# Altium schematic sheet IOT_GRN_MAIN V1.0 A - CONNECTORS.SchDoc
size A4; SheetNumber: 3; SheetTotal: 4
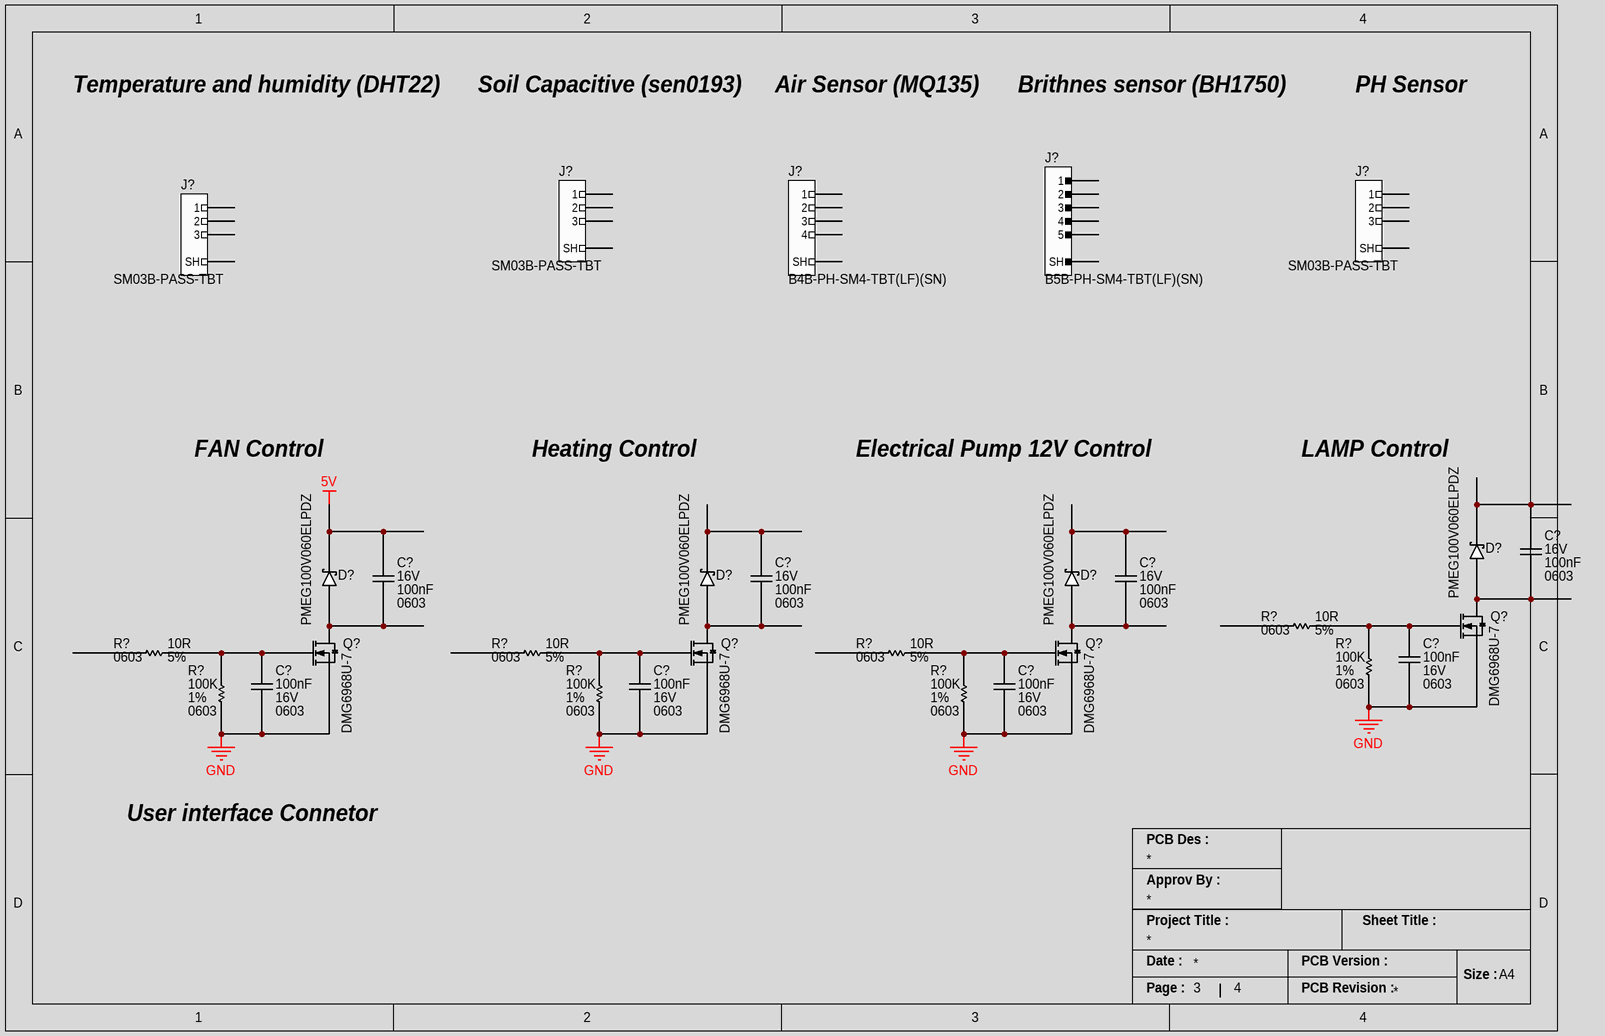
[diagram p0: IOT_GRN_MAIN V1.0 A - CONNECTORS.SchDoc]

## Parts
(Parts that share a designator on the sheet are numbered #1, #2 ... from top to bottom, then left to right.)
C?#1  Voltage: 16V  Capacitance: 100nF  Case/Package: 0603  [CAP_0603_CAPC1608X08N]  (hidden comment: CL10B104KO8NNNC)
C?#2  Voltage: 16V  Capacitance: 100nF  Case/Package: 0603  [CAP_0603_CAPC1608X08N]  (hidden comment: CL10B104KO8NNNC)
C?#3  Voltage: 16V  Capacitance: 100nF  Case/Package: 0603  [CAP_0603_CAPC1608X08N]  (hidden comment: CL10B104KO8NNNC)
C?#4  Voltage: 16V  Capacitance: 100nF  Case/Package: 0603  [CAP_0603_CAPC1608X08N]  (hidden comment: CL10B104KO8NNNC)
C?#5  Voltage: 16V  Capacitance: 100nF  Case/Package: 0603  [CAP_0603_CAPC1608X08N]  (hidden comment: CL10B104KO8NNNC)
C?#6  Voltage: 16V  Capacitance: 100nF  Case/Package: 0603  [CAP_0603_CAPC1608X08N]  (hidden comment: CL10B104KO8NNNC)
C?#7  Voltage: 16V  Capacitance: 100nF  Case/Package: 0603  [CAP_0603_CAPC1608X08N]  (hidden comment: CL10B104KO8NNNC)
C?#8  Voltage: 16V  Capacitance: 100nF  Case/Package: 0603  [CAP_0603_CAPC1608X08N]  (hidden comment: CL10B104KO8NNNC)
D?#1  PMEG100V060ELPDZ  [DIO_SCKTY_PMEG060V100EPDAZ]
D?#2  PMEG100V060ELPDZ  [DIO_SCKTY_PMEG060V100EPDAZ]
D?#3  PMEG100V060ELPDZ  [DIO_SCKTY_PMEG060V100EPDAZ]
D?#4  PMEG100V060ELPDZ  [DIO_SCKTY_PMEG060V100EPDAZ]
J?#1  SM03B-PASS-TBT  [CONN_JST_SM03B-PASS-TBT_LF_SN_MFG]
J?#2  SM03B-PASS-TBT  [CONN_JST_SM03B-PASS-TBT_LF_SN_MFG]
J?#3  SM03B-PASS-TBT  [CONN_JST_SM03B-PASS-TBT_LF_SN_MFG]
J?#4  B4B-PH-SM4-TBT(LF)(SN)  [CONN_JST_0_MFG_4P]
J?#5  B5B-PH-SM4-TBT(LF)(SN)  [CONN_JST_0_MFG_5P]
Q?#1  DMG6968U-7  [SOT_23_3_MMBT2907A-13]
Q?#2  DMG6968U-7  [SOT_23_3_MMBT2907A-13]
Q?#3  DMG6968U-7  [SOT_23_3_MMBT2907A-13]
Q?#4  DMG6968U-7  [SOT_23_3_MMBT2907A-13]
R?#1  Resistance: 10R  Tolerance: 5%  Case/Package: 0603  [RES_0603_RESC1608X04N]  (hidden comment: RC0603JR-0710RL)
R?#2  Resistance: 10R  Tolerance: 5%  Case/Package: 0603  [RES_0603_RESC1608X04N]  (hidden comment: RC0603JR-0710RL)
R?#3  Resistance: 10R  Tolerance: 5%  Case/Package: 0603  [RES_0603_RESC1608X04N]  (hidden comment: RC0603JR-0710RL)
R?#4  Resistance: 10R  Tolerance: 5%  Case/Package: 0603  [RES_0603_RESC1608X04N]  (hidden comment: RC0603JR-0710RL)
R?#5  Resistance: 100K  Tolerance: 1%  Case/Package: 0603  [RES_0603_RESC1608X04N]  (hidden comment: RC0603FR-07100KL)
R?#6  Resistance: 100K  Tolerance: 1%  Case/Package: 0603  [RES_0603_RESC1608X04N]  (hidden comment: RC0603FR-07100KL)
R?#7  Resistance: 100K  Tolerance: 1%  Case/Package: 0603  [RES_0603_RESC1608X04N]  (hidden comment: RC0603FR-07100KL)
R?#8  Resistance: 100K  Tolerance: 1%  Case/Package: 0603  [RES_0603_RESC1608X04N]  (hidden comment: RC0603FR-07100KL)

## Nets
5V: C?#2.2 D?#2.K
GND: C?#5.1 C?#6.1 C?#7.1 C?#8.1 Q?#1.S Q?#2.S Q?#3.S Q?#4.S R?#5.1 R?#6.1 R?#7.1 R?#8.1
NetC?#1_1: C?#1.1 D?#1.A Q?#1.D
NetC?#1_2: C?#1.2 D?#1.K
NetC?#2_1: C?#2.1 D?#2.A Q?#2.D
NetC?#3_1: C?#3.1 D?#3.A Q?#3.D
NetC?#3_2: C?#3.2 D?#3.K
NetC?#4_1: C?#4.1 D?#4.A Q?#4.D
NetC?#4_2: C?#4.2 D?#4.K
NetC?#5_2: C?#5.2 Q?#1.G R?#1.2 R?#5.2
NetC?#6_2: C?#6.2 Q?#2.G R?#2.2 R?#6.2
NetC?#7_2: C?#7.2 Q?#3.G R?#3.2 R?#7.2
NetC?#8_2: C?#8.2 Q?#4.G R?#4.2 R?#8.2

Not connected (* = marked no-connect by the designer): J?#1 1 2 3 SH; J?#2 1 2 3 SH; J?#3 1 2 3 SH; J?#4 0(SH) 1 2 3 4; J?#5 0(SH) 1 2 3 4 5; R?#1 1; R?#2 1; R?#3 1; R?#4 1

## Notes on the sheet
- Temperature and humidity (DHT22)
- Soil Capacitive (sen0193)
- Air Sensor (MQ135)
- Brithnes sensor (BH1750)
- PH Sensor
- FAN Control
- Heating Control
- Electrical Pump 12V Control
- LAMP Control
- User interface Connetor
- PCB Des :
- Approv By :
- Project Title :
- Sheet Title :
- Date :
- PCB Version :
- Size :
- A4
- Page :
- PCB Revision :

## Library data of the parts
C?#1-C?#8 = CAP_100NF_16V_X7R_0603: Ceramic capacitor SMD-0603 100nF /16V X7R# K +-10%, Samsung, RoHS; Dielectric: X7R; Tolerance: 10%; Manufacturer: Samsung; Manufacturer Part Number: CL10B104KO8NNNC; RoHS: Yes; Category: Ceramic Capacitors; Stock 1: 9799745; Pricing 1: 1=0.10000, 10=0.02700, 50=0.01500, 100=0.01220, 500=0.00874, 1000=0.00686 (USD); Mount: Surface Mount; Case Code (Metric): 1608; Case Code (Imperial): 0603; Material: Ceramic; Contact Plating: Tin; Min Operating Temperature: -55°C; Max Operating Temperature: 125°C; Packaging: Tape and Reel; Package Quantity: 1; Voltage Rating: 16V; Series: CL; Length: 1.6mm; Width: 0.031inch; Height: 0.8mm; Depth: 0.8mm; Thickness: 0.035inch; Radiation Hardening: No; Lead Free: Lead Free; RoHS Compliant: Yes; ComponentLink1URL: https://datasheet.ciiva.com/25805/cl10b104ko8nnnc-25805483.pdf?src-supplier=Digi-Key; ComponentLink1Description: https://datasheet.ciiva.com/25805/cl10b104ko8nnnc-25805483.pdf?src-supplier=Digi-Key; ComponentLink2URL: https://datasheet.ciiva.com/26838/getdatasheetpartid-357417-26838418.pdf?src-supplier=Verical; ComponentLink2Description: https://datasheet.ciiva.com/26838/getdatasheetpartid-357417-26838418.pdf?src-supplier=Verical; ComponentLink3URL: https://datasheet.ciiva.com/29198/456679-da-01-en-vs-kondensator-0603-29198846.pdf?src-supplier=Conrad; ComponentLink3Description: https://datasheet.ciiva.com/29198/456679-da-01-en-vs-kondensator-0603-29198846.pdf?src-supplier=Conrad; Supplier 1: Digi-Key; Supplier 2: Newark; Supplier 3: Mouser; Supplier Part Number 1: 1276-1005-1-ND; Supplier Part Number 2: 82AC9325; Supplier Part Number 3: 187-CL10B104KO8NNNC
D?#1-D?#4 = DIO_SCTKY_100V_6A_PMEG100V060ELPDZ: DIODESCHOTTKY100V6ACFP15; Manufacturer: Nexperia; Supplier 1: Digikey; Manufacturer Part Number: PMEG100V060ELPDZ; RoHS: Yes; Category: Schottky Diodes; Stock 1: 60422; Pricing 1: 1=0.58, 10=0.504, 100=0.3491, 500=0.29166 (USD); RoHS Compliant: Yes; ComponentLink1URL: http://www.farnell.com/datasheets/2341403.pdf?src-supplier=Farnell; ComponentLink1Description: http://www.farnell.com/datasheets/2341403.pdf?src-supplier=Farnell; ComponentLink2URL: https://datasheet.octopart.com/PMEG100V060ELPDZ-Nexperia-datasheet-87796136.pdf?src-supplier=Future+Electronics; ComponentLink2Description: https://datasheet.octopart.com/PMEG100V060ELPDZ-Nexperia-datasheet-87796136.pdf?src-supplier=Future+Electronics
J?#1-J?#3 = CONN_JST_PH_3P_2MM_SM03B-PASS-TBT: Conn Header SMD R/a 3POS 2MM; Manufacturer: JST; Supplier 1: Digikey; Manufacturer Part Number: SM03B-PASS-TBT; RoHS: No; Stock 1: 258662; Pricing 1: 1=0.78, 10=0.657, 100=0.5904, 500=0.48304, 1000=0.42938, 2000=0.40254, 3000=0.38912, 5000=0.3757, 10000=0.35692, 25000=0.34887 (USD); Supplier Part Number 1: 455-SM03B-PASS-TBTCT-ND
J?#4 = CONN_JST_PH_4P_2mm_JLCPCB: 1x4P PH 1 Tin 2mm 4 -25℃~+85℃ 2A Copper Alloy Brick nogging SMD,P=2mm  Wire To Board / Wire To Wire Connector ROHS; Manufacturer: JST; Number of Positions: 4; Connector Type: Male Pin; Contact Resistance: 20mR; Max Voltage Rating (AC): 100V; Pitch: 0.079inch; Manufacturer Part Number: B4B-PH-SM4-TBT(LF)(SN); RoHS: Yes; Category: Headers and Wire Housings; Mount: Surface Mount; Contact Plating: Tin,Copper; Color: Natural; Contact Material: Copper Alloy; Housing Color: Beige; Housing Material: Polyamide; Min Operating Temperature: -25°C; Max Operating Temperature: 85°C; Number of Rows: 1; Packaging: Tape and Reel; Termination: Solder; Series: PH; Contact Type: Male Pin; Max Current Rating: 2A; Package Quantity: 1; Orientation: Straight; Fastening Type: Detent; Length: 11.95mm; Depth: 5mm; Contact Mating Length: 0.13inch; Lead Free: Lead Free; ComponentLink1URL: https://datasheet.ciiva.com/16291/b4b-ph-sm4-tbtlfsn-16291402.pdf?src-supplier=Future+Electronics; ComponentLink1Description: https://datasheet.ciiva.com/16291/b4b-ph-sm4-tbtlfsn-16291402.pdf?src-supplier=Future+Electronics; ComponentLink2URL: https://datasheet.ciiva.com/6840/eph-6840791.pdf?src-supplier=Digi-Key; ComponentLink2Description: https://datasheet.ciiva.com/6840/eph-6840791.pdf?src-supplier=Digi-Key; Supplier: Jlcpcb; JLCPCB Part Number: C265116
J?#5 = CONN_JST_PH_5P_2mm: Conn Shrouded Header HDR 5 POS 2mm Solder ST Top Entry SMD T/R; Manufacturer: JST; Number of Positions: 5; Supplier 1: Digi-Key; Manufacturer Part Number: B5B-PH-SM4-TBT(LF)(SN); RoHS: Yes; Category: Headers and Wire Housings; Stock 1: 18001; Pricing 1: 1=0.97000, 10=0.81500, 100=0.73220, 500=0.59904 (USD); Mount: Surface Mount; Termination: Solder; Pitch: 2mm; Lead Free: Lead Free; ComponentLink1URL: https://datasheet.ciiva.com/16417/eph-16417918.pdf?src-supplier=Future+Electronics; ComponentLink1Description: https://datasheet.ciiva.com/16417/eph-16417918.pdf?src-supplier=Future+Electronics; Supplier Part Number 1: 455-3362-1-ND
Q?#1-Q?#4 = TRANS_FET_CH_N_20V_6.5A_DMG6968U-7: Trans Mosfet N-ch 20V 6.5A 3-PIN SOT-23 T/r Trans Mosfet N-ch 20V 6.5A 3-PIN SOT-23 T/r; Manufacturer: Diodes; Rise Time: 66ns; Turn-Off Delay Time: 613ns; Turn-On Delay Time: 54ns; Fall Time: 205ns; Gate to Source Voltage (Vgs): 12V; Polarity: N-CHANNEL; Nominal Vgs: 500mV; Input Capacitance: 151pF; Max Power Dissipation: 1.3W; Rds On Max: 25mR; Number of Channels: 1; Drain-source On Resistance-Max: 36mR; Supplier 1: Digikey; Manufacturer Part Number: DMG6968U-7; RoHS: Yes; Category: MOSFETs; Stock 1: 575891; Pricing 1: 1=0.37, 10=0.289, 100=0.1732, 500=0.16034, 1000=0.10903 (USD); Mount: Surface Mount; Case/Package: SOT-23-3; Number of Pins: 3; Weight: 0.000282oz; Min Operating Temperature: -55°C; Max Operating Temperature: 150°C; Packaging: Tape and Reel; Package Quantity: 1; Continuous Drain Current (ID): 6.5A; Series: -; Drain to Source Voltage (Vdss): 20V; Drain to Source Resistance: 25mR; Threshold Voltage: 500mV; Length: 2.9mm; Width: 1.3mm; Height: 1mm; Radiation Hardening: No; Reach SVHC Compliant: No; Lead Free: Lead Free; RoHS Compliant: Yes; ComponentLink1URL: https://datasheet.ciiva.com/5774/ds31738-5774992.pdf?src-supplier=Farnell; ComponentLink1Description: https://datasheet.ciiva.com/5774/ds31738-5774992.pdf?src-supplier=Farnell; ComponentLink2URL: https://datasheet.ciiva.com/22712/1915638-22712395.pdf?src-supplier=Element14; ComponentLink2Description: https://datasheet.ciiva.com/22712/1915638-22712395.pdf?src-supplier=Element14; Supplier Part Number 1: DMG6968UDICT-ND
R?#1-R?#4 = RES_10R_5%_100mW_0603: SMD Chip Resistor, 10 Ohm, ± 5%, 100 mW, 0603 [1608 Metric], Thick Film, General Purpose; Manufacturer: Yageo; Temperature Coefficient: 200ppm/°C; Voltage Rating (DC): 50V; Power Rating: 100mW; Supplier 1: Digi-Key; Manufacturer Part Number: RC0603JR-0710RL; RoHS: Yes; Category: Chip SMD Resistors; Stock 1: 769777; Pricing 1: 1=0.1, 10=0.024, 50=0.0154, 100=0.013, 500=0.00894, 1000=0.00773 (USD); Number of Pins: 2; Case Code (Imperial): 0603; Case Code (Metric): 1608; Size Code: 0603; Min Operating Temperature: -55°C; Max Operating Temperature: 155°C; Resistor Type: Thick Film; Packaging: Tape and Reel; Voltage Rating: 50V; Termination: SMD/SMT; Features: Moisture Resistant; Series: RC; Max Power Dissipation: 100mW; Number of Terminations: 2; Construction: Rectangular; Resistance Tolerance: 5%; Length: 1.6mm; Width: 0.8mm; Depth: 0.8mm; Reach SVHC Compliant: No; Lead Free: Lead Free; Military Standard: Not; RoHS Compliant: Yes; ComponentLink1URL: https://datasheet.ciiva.com/46395/443971-46395069.pdf?src-supplier=Element14; ComponentLink1Description: https://datasheet.ciiva.com/46395/443971-46395069.pdf?src-supplier=Element14; ComponentLink2URL: https://datasheet.ciiva.com/7746/443971-7746431.pdf?src-supplier=Element14; ComponentLink2Description: https://datasheet.ciiva.com/7746/443971-7746431.pdf?src-supplier=Element14; Supplier Part Number 1: 311-10GRCT-ND
R?#5-R?#8 = RES_100K_1%_100mW_0603: RES SMD 100K OHM 1% 1/10W 0603; Manufacturer: Yageo; Temperature Coefficient: 100ppm/°C; Power Rating: 100mW; Voltage Rating: 50V; Working Voltage: 75V; Supplier 1: Digi-Key; Manufacturer Part Number: RC0603FR-07100KL; RoHS: Yes; Category: Chip SMD Resistors; Stock 1: 11038732; Pricing 1: 1=0.10000, 10=0.01900, 100=0.00770, 1000=0.00345, 2500=0.00300 (USD); Number of Pins: 2; Case Code (Imperial): 0603; Case Code (Metric): 1608; Min Operating Temperature: -55°C; Max Operating Temperature: 155°C; Resistor Type: Thick Film; Voltage Rating (DC): 50V; Packaging: Tape and Reel; Termination: SMD/SMT; Number of Terminations: 2; Features: Moisture Resistant; Series: RC; Max Power Dissipation: 100mW; Resistance Tolerance: 1%; Construction: Rectangular; Technology: THICK FILM; Length: 1.6mm; Width: 0.8mm; Height: 0.45mm; Depth: 0.8mm; Reach SVHC Compliant: Yes; Military Standard: Not; Lead Free: Lead Free; RoHS Compliant: Yes; ComponentLink1URL: https://datasheet.ciiva.com/11808/0900766b80f96399-11808107.pdf?src-supplier=Rs; ComponentLink1Description: https://datasheet.ciiva.com/11808/0900766b80f96399-11808107.pdf?src-supplier=Rs; ComponentLink2URL: https://datasheet.ciiva.com/7983/443971-7983593.pdf?src-supplier=Element14; ComponentLink2Description: https://datasheet.ciiva.com/7983/443971-7983593.pdf?src-supplier=Element14; ComponentLink3URL: https://datasheet.ciiva.com/22747/443971-22747516.pdf?src-supplier=Element14; ComponentLink3Description: https://datasheet.ciiva.com/22747/443971-22747516.pdf?src-supplier=Element14; ComponentLink4URL: https://datasheet.ciiva.com/46440/1868787-46440889.pdf?src-supplier=Element14; ComponentLink4Description: https://datasheet.ciiva.com/46440/1868787-46440889.pdf?src-supplier=Element14; ComponentLink5URL: https://datasheet.ciiva.com/7746/1738695-7746235.pdf?src-supplier=Element14; ComponentLink5Description: https://datasheet.ciiva.com/7746/1738695-7746235.pdf?src-supplier=Element14; ComponentLink6URL: https://datasheet.ciiva.com/7746/1738695-7746234.pdf?src-supplier=Element14; ComponentLink6Description: https://datasheet.ciiva.com/7746/1738695-7746234.pdf?src-supplier=Element14; Supplier Part Number 1: 311-100KHRDKR-ND